# Altium schematic sheet CHIBI SMPS_20181126.SchDoc: Title (part 2 of 2)
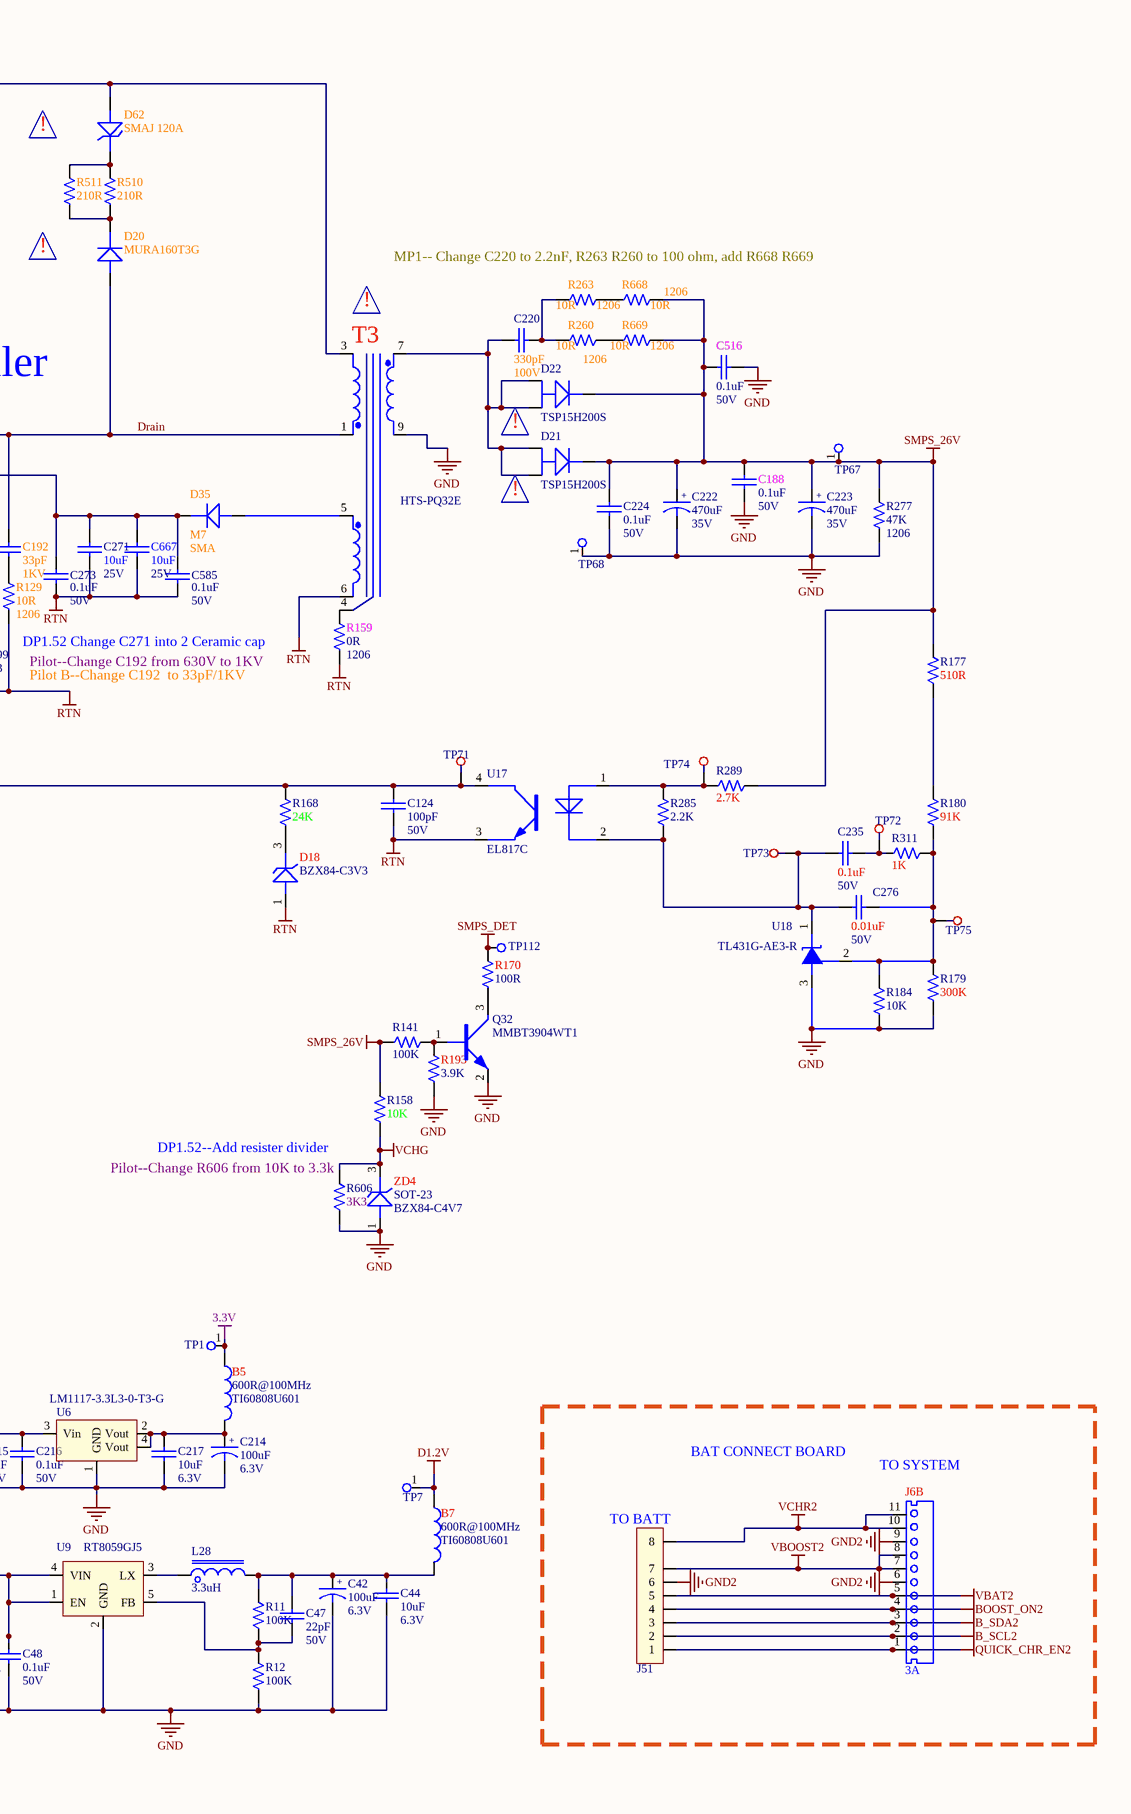
[diagram p2: CHIBI SMPS_20181126.SchDoc, right]

## Library data of the parts
B1-B12 = BEAD 0603 600R@100MHz TI60808U601: CHIP BEAD 600 OHM 25% 100MHZ SMD 0603; SAP: T710500000800; Vendor Code: 10020396; Vendor Name: 深圳市麦新电子有限公司; MFG: 麦新; Impedence: 600R; Current: 1A; Frequency: 100MHZ; Type: INDUCTOR
  B1 B2: MFG Part: TI60808U601
BD1 = GBLA06: DIODE 600V 3A GBLA06 TSC K; MFG: TSC    (台灣半導體); CREAT_NAME: Nathan; SAP: T571002850104; Vendor Code: *; Vendor Name: *; Type: BRIDGE; CREAT_TIME: 17-Jan-2017; MFG Part: GBLA06
C42 C120 C214 = CAP E 100uF 6.3V 20% SMD: CHIP ELECT 100uF 6.3V 20% SMD 5x5.3mm; SAP: T551101414000; Vendor Name: 深圳市春明电子有限公司; Vendor Code: 10020343; MFG: 春明电子; Type: Capacitor; PACKAGE: CASE - C; MFG Part: *; Other: *; Tolerance: 20%
C44 C50 C215 C217 = CAP0603 10uF 6.3V 20%: CHIP CAP 10uF 6.3V 20% 0603 X5R; SAP: T540000002118; Vendor Code: 10010262; Vendor Name: 东莞市晴远电子有限公司; Type: Capacitor; PACKAGE: CAPC0603; MFG: *; MFG Part: *; Other: X5R; Tolerance: 20%
C45 C48 C161 C162 C216 C234 C237 C245 C273 C505 C585 C677 C678 = CAP0402 0.1uF 50V 10%: CAP, CER, 0.1uF, 10%, 50V, X7R, 0402, RoHS; SAP: T542011047508; Type: Capacitor; CREATE_NAME: TOM@Deftronics; PACKAGE: CAPC0402; Vendor Name: *; MFG: *; MFG Part: *; Other: X7R; Tolerance: 10%; CREATE_TIME: 13-May-2014
C46 = CAP0402 0.1uF 50V 10%_X5R_MURATA: CAP X5R .10UF 50V +-10% 0402 MURATA L; Tolerance: 10%; Type: Capacitor; CREATE_NAME: Cherry.Chen; DIP&SMD: SMD; SAP: T545011047505; PACKAGE: CAPC0402; Vendor Name: *; MFG: MURATA; MFG Part: *; Other: X5R; CREATE_TIME: 25-Feb-2016; Customer Specific: N/A
C47 = CAP0402 22pF 50V 5%: CHIP CAP 5% 50V 0402 NPO 22pF; SAP: T541012206508; Type: Capacitor; CREATE_NAME: GordonL@Deftronics; PACKAGE: CAPC0402; Vendor Code: *; Vendor Name: *; MFG: *; MFG Part: *; Other: NPO; Tolerance: 5%; CREATE_TIME: 08-MAR-2013
C51 C52 C58 C60 = CAP0805 10uF 25V 10%: CAP, CER, 10uF, 10%, 25V, X5R, 0805, RoHS; SAP: T545031067408; Type: Capacitor; CREATE_NAME: TOM@Deftronics; PACKAGE: CAP0805; Vendor Code: *; Vendor Name: *; MFG: *; MFG Part: *; Other: X5R; Tolerance: 10%; CREATE_TIME: 13-May-2014
C109 C227 C666 = CAP1210 0.1uF 500V 10%_X7R_KEMET: CAP X7R .10UF 500V +-10% 1210 KEMET L; Tolerance: 10%; Type: Capacitor; CREATE_NAME: Nathan; SAP: T542051047906; PACKAGE: CAP1210; Vendor Code: *; Vendor Name: *; MFG: KEMET; MFG Part: *; Other: X7R; CREATE_TIME: 24-Oct-2016
C111 C275 = CAP E 220uF 35V 20% SMD: CHIP ELECT 20% 35V SMD D8xL10.2mm 220uF; SAP: T551221452010; Type: Capacitor; PACKAGE: CASE - D; Vendor Name: *; Vendor Code: *; MFG: *; MFG Part: *; Other: *; Tolerance: 20%
C121 C222 C223 = CAP E 470uF 35V 20% SMD_VZH471M1V1013-TR0: E 470UF 35V +-20% 10*12. VZH471M1V K; MFG: LELON; Tolerance: 20%; Type: Capacitor; CREAT NAME: Nathan; SAP: T551471455000; PACKAGE: 470uF/35V; Vendor Name: *; Vendor Code: *; MFG Part: VZH471M1V1013-TR0; Other: *; CREAT TIME: 08-July-2016
C124 C232 = CAP0603 100pF 50V 5% - PXL410370-1010: GP CHIP CAP 100pF 50V 5% 0603 TYPE NPO; SAP: T541021016508; Vendor Code: 10010262; Vendor Name: ???????????; Type: Capacitor; PACKAGE: CAPC0603; MFG: *; MFG Part: *; Other: NPO; Tolerance: 5%
C125 = CAP0603 390pF 50V 5%_NPO_WALSIN: CAP NPO 390PF 50V +-5% 0603 WALSIN L; Tolerance: 5%; Type: Capacitor; CREATE_NAME: Nathan; SAP: T541023916508; PACKAGE: CAPC0603; Vendor Name: *; MFG: WALSIN; MFG Part: *; Other: NPO; CREATE_TIME: 13-July-2016
C131 = CAP0805 4.7uF 50V 10%: CHIP CAP 4.7uF 50V 10% 0805 TYPE X7R; SAP: T545034757508; Vendor Code: 10010262; Vendor Name: 东莞市晴远电子有限公司; Type: Capacitor; CREAT NAME: Nathan; PACKAGE: CAPC0805; MFG: *; MFG Part: *; Other: X7R; Tolerance: 10%; CREAT TIME: 16-SEP-2015
C182 = CAP0603 1uF 50V 10%_X7R_WALSIN: CAP X7R 1.0UF 50V +-10% 0603 WALSIN L; Tolerance: 10%; Type: Capacitor; CREATE_NAME: Nathan; SAP: T542021057508; PACKAGE: CAPC0603; Vendor Name: *; MFG: WALSIN; MFG Part: *; Other: X7R; CREATE_TIME: 13-July-2016
C188 C210 C224 C239 C350 C516 C630 C631 = CAP0603 0.1uF 50V 10% - PXL456470-1040: GP CHIP CAP 0.1uF 50V 10% 0603 TYPE X7R; SAP: T542021047508; Vendor Code: 10010262; Vendor Name: ???????????; Type: Capacitor; PACKAGE: CAPC0603; MFG: *; MFG Part: *; Other: X7R; Tolerance: 10%
C192 = CAP1206 33pF 1KV 5%_NPO_WALSIN: CAP NPO 33PF 1KV +-5% 1206 WALSIN L; MFG: WALSIN (華新); Tolerance: 5%; Type: Capacitor; CREATE_NAME: Nathan; SAP: T541043306H08; PACKAGE: CAP1206; Vendor Code: *; Vendor Name: *; MFG Part: *; Other: NPO; CREATE_TIME: 27-Dec-2017
C193 C503 = CAP0402 330pF 50V 5%: CHIP CAP WALSIN 5% 50V 0402 NPO 330pF; SAP: T541013316508; CREATE_NAME: GordonL@Deftronics; Type: Capacitor; PACKAGE: CAPC0402; Vendor Code: *; Vendor Name: *; MFG: Walsin; MFG Part: *; Other: NPO; Tolerance: 5%; CREATE_TIME: 19-OCT-2012
C195 C235 = CAP0603 0.1uF 50V 10% - PXL456470-1040: GP CHIP CAP 0.1uF 50V 10% 0603 TYPE X7R; SAP: T542021047508; Vendor Code: 10010262; Vendor Name: 东莞市晴远电子有限公司; Type: Capacitor; PACKAGE: CAPC0603; MFG: *; MFG Part: *; Other: X7R; Tolerance: 10%
C211 = CAP 0.22uF 275V 10% -T6W18H12 PH15: COND SAFETY 0.22uF 275V 10% X2; MFG Part: MPX224KP2APEL1DH02; SAP: T564224313080; MFG: STRONG(實全); Type: Capacitor; CREATE_NAME: Nathan; PACKAGE: *; Vendor Name: *; Vendor Code: *; Other: X2; Tolerance: 10%; CREATE_TIME: 13-AUG-2015
C212 = CAP SAFETY 0.47uF 275V 10%: COND SAFETY 0.47uF 275V 10% X2; SAP: T564474313090; Vendor Name: 惠州市佳维诚电子有限公司; Vendor Code: 10020154; Type: Capacitor; PACKAGE: 0.47uF/275V; MFG Part: *; Other: X2; Tolerance: 10%
C218 C219 = CAP E Aluminum 82uF 450V 20%: E 82UF 450V +-20% 18X25M KM820M450K250A K; MFG: CAPXON; Tolerance: 20%; Type: Capacitor; CREAT_NAME: Nathan; SAP: T5528204D3010; PACKAGE: 82uF/450V; Vendor Name: *; Vendor Code: *; MFG Part: KM820M450K250A; Other: *; CREAT_TIME: 17-Jan-2017
C220 = CAP0603 330pF 100V 10% - PXL4564A0-3310: CHIP CAP 330pF 100V 10%; SAP: T542023317608; Vendor Code: 10010262; Vendor Name: 东莞市晴远电子有限公司; Type: Capacitor; PACKAGE: CAPC0603; MFG: *; MFG Part: *; Other: *; Tolerance: 10%
C225 = CAP 2200PF Y1 102M40AXC3  Y1 222M40AXC3: 2200PF 400VAC ±20%; MFG: 实全电子; Type: Capacitor; CREATE_NAME: Tom; SAP: T564222414030; PACKAGE: *; Vendor Code: *; Vendor Name: *; MFG Part: *; Other: *; Tolerance: 20%; CREATE_TIME: 20-Aug-2015
C230 = CAP1206 100pF 500V 5%: CHIP CAP 100pF 500V 5% 1206 NPO; MFG Part: 68PF  1KV  1206; Vendor Code: 10010262; Vendor Name: 东莞市晴远电子有限公司; Type: Capacitor; Value: 22PpF; PACKAGE: CAPC1206; MFG: *; Other: NPO; Tolerance: 5%; Voltage: 500V
C238 C253 = CAP0603 0.1uF 50V 10% - PXL456470-1040: GP CHIP CAP 0.1uF 50V 10% 0603 TYPE X7R; SAP: T542021047508; Vendor Code: 10010262; Type: Capacitor; PACKAGE: CAPC0603; MFG: *; MFG Part: *; Other: X7R; Tolerance: 10%
C264 = CAP0603 100pF 50V 5% - PXL410370-1010: GP CHIP CAP 100pF 50V 5% 0603 TYPE NPO; SAP: T541021016508; Vendor Code: 10010262; Vendor Name: 东莞市晴远电子有限公司; Type: Capacitor; PACKAGE: CAPC0603; MFG: *; MFG Part: *; Other: NPO; Tolerance: 5%
C271 C667 = CAP1206 10uF 25V 10%: CHIP CAP 10UF 25V 10% 1206 X5R; SAP: T542041067408; Vendor Code: 10010262; Vendor Name: 东莞市晴远电子有限公司; Type: Capacitor; PACKAGE: CAPC1206; MFG: *; MFG Part: *; Other: X5R; Tolerance: 10%
C276 = CAP0603 0.01uF 50V 5%_X7R_WALSIN: CAP X7R .01UF 50V +-5% 0603 WALSIN L; Tolerance: 5%; Type: Capacitor; CREATE_NAME: Nathan; SAP: T542021036508; PACKAGE: CAPC0603; Vendor Name: *; MFG: WALSIN; MFG Part: *; Other: X7R; CREATE_TIME: 13-July-2016
C298 C304 = CAP0603 10uF 10V 20%_T54000000260E: CAP 10UF 10V +-20% 0603X5R SAMSUNG L; Other: X5R; Tolerance: 20%; Type: Capacitor; CREATE_NAME: Cherry.Chen; SAP: T54000000260E; PACKAGE: CAPC0603; Vendor Code: *; Vendor Name: *; MFG: SAMSUNG; MFG Part: *; CREATE_TIME: 25-Feb-2016
C299 C629 = CAP E  22uF 25V 20%_SMD: CHIP ELECT 20% 25V 5MM; SAP: T551220442020; MFG: CAPXON; Type: Capacitor; CREATE NAME: Tom; Vendor Name: *; Vendor Code: *; MFG Part: *; Other: *; Tolerance: 20%; CREATE TIME: 01-Apr-2015
C501 C502 = CAP0402 0.01uF 50V 10%: CAP, CER, 0.01uF, 10%, 50V, X7R, 0402, RoHS; SAP: T542011037508; Type: Capacitor; CREATE_NAME: Evan@Deftronics; PACKAGE: CAPC0402; Vendor Name: *; MFG: *; MFG Part: *; Other: X7R; Tolerance: 10%; CREATE_TIME: 26-May-2014
C592 C597 = CAP0402 10pF 50V_5%_C0G_SAMSUNG: CAP 10PF 50V +-5% 0402C0G SAMSUNG L; Other: C0G; Tolerance: 5%; Type: Capacitor; CREATE_NAME: Nathan; SAP: DNI; PACKAGE: CAPC0402; Vendor Name: *; MFG: SAMSUNG; MFG Part: *; CREATE_TIME: 17-Aug-2016
C679 = CAP0603 0.022uF 50V 10%: GP CHIP CAP 0.022uF 50V 10%; SAP: T542022237508; Vendor Code: 10010262; Vendor Name: 东莞市晴远电子有限公司; Type: Capacitor; PACKAGE: CAPC0603; MFG: *; MFG Part: *; Other: *; Tolerance: 10%
CY1 CY2 = CAP SAFETY 1nF 400V 10% Y2_PLY1365K0-1040: SAFETY CAP Y2 10% 400V -40'~+100'C 1nF Y5P; MFG: 实全; Create Name: Tom; SAP: DNI; PACKAGE: 1nF\400V; Vendor Name: *; Vendor Code: *; MFG Part: *; Other: Y5P; Tolerance: 10%; Create Time: 27-Apr-2015; Type: Capacitor; Voltage: 400V
D11 D25 D28 = SBR3U40P1-7: DIODE 40V 3A SBR3U40P1-7 DIODE K; MFG: DIODES  (ZETEX); CREATE_NAME: Nathan; SAP: T571002830230; Vendor Name: *; Vendor Code: *; Voltage: 40V; Current: 3A; Type: DIODE; CREATE_TIME: 17-Nov-2016; MFG Part: SBR3U40P1-7
D18 = BZX84-C3V3: CHIP ZENER 3.3V 5% 0.5W SOT-23; MFG: NXP; Power: 500MW; CREATE_NAME: Tom; SAP: T573000910415; Tolerance: 5%; Voltage: 3.3V; Current: *; Vendor Code: *; Vendor Name: *; Type: ZENER; CREATE_TIME: 04-Jan-2016; MFG Part: BZX84-C3V3
D19 = SK34B_TSC: SWITC 28V 3A SK34B TSC K; MFG: TSC    (台灣半導體); Vrrm: 40V; Type: DIODE; Ifsm: 70A; CREAT NAME: Nathan; SAP: T572006222208; Vendor Name: *; Vendor Code: *; If(av): 3A; CREAT TIME: 09-Nov-2017; Vdc: 40V; Vr(rms): 28V
D20 = MURA160T3G: DIODE 600V 1A MURA160T3G ON K; MFG: ON Semiconductor; Current: 1.0A; CREATE_NAME: Nathan; SAP: T571002720225; Vendor Name: *; Vendor Code: *; Voltage: 600V; CREATE_TIME: 31-Oct-2017; Type: DIODE; Package: SMA; MFG Part: MURA160T3G
D21 D22 = TSP15H200S: SWITC 200V 15A TSP15H200S TSC G; MFG: Taiwan Semiconductor; Type: DIODE; CREATE_NAME: Tom; SAP: T572005721008; Vdc: *; Ir: *; Vendor Code: *; Vendor Name: *; CREATE_TIME: 22-Feb-2016; Vf: *; MFG Part: TSP15H200S
D29 D30 D35 = DIO M7: DIODE 1000 1.0A M7 PINGW K; MFG: PINGWEI   (重慶平偉); Voltage: 1000V; Current: 1A; CREAT NAME: Nathan; SAP: T571002880658; Vendor Name: *; Vendor Code: *; Type: DIODE; Package: SMA; CREAT TIME: 11-Sep-2017
D36 = 1N4148WS: DIODE SW 1N4148 VF=0.7V SOD-323; MFG: TW SEMICONDUCTOR; SAP: T572005070208; Voltage: 100V; Current: 150MA; Vendor Name: *; Vendor Code: *; Type: DIODE; Package: SOD-323; MFG Part: 1N4148WS
D55 D56 = DAN217S3-0-T1-G: ITC 100V 215MA DAN217S3-0-T1-G CYSTE K; MFG: CYSTECH; Type: DIODES; Create Name: Nathan; SAP: T572006171251; Vendor Name: *; Vendor Code: *; MFG Part: DAN217S3-0-T1-G; Create Time: 08-Sep-2017
D62 = SMAJ 120A: SWITC 120V 1.0A SMAJ120A TSC K; MFG: Taiwan Semiconductor; Ippm: 1.6A; CREATE_NAME: Nathan; Type: DIODE; SAP: T572006272108; Vendor Name: *; Vendor Code: *; Voltage: 120V; CREATE_TIME: 31-Oct-2017; Package: SMA; MFG Part: SMAJ 120A
F1 = FUSE-TE5-5A250V_L8.5W4H8: FUSE DIP FUSE 250V 5A 8X8.5 39215 K; MFG: Littelfuse; Create Name: Nathan; SAP: T690100003600; Vendor Code: *; Vendor Name: *; Current: 5A; Voltage: 250V; Type: FUSE; Create Time: 11-Sep-2017
J2A = HOUSING  6P 2X3 PH=2.54mm 180  H8.5mm_2.54Y-2X3P-11.5: HOUSING DUAL PIN 2*3PIN 2.54MM DIP 180 K; MFG: JINJIA; Create Name: Nathan; Value: 2.54mm; SAP: T690300110100; MFG Part: 2.54Y-2X3P-11.5; Vendor Name: *; Vendor Code: *; Type: Connector; Current: *; Create Time: 11-Sep-2017
J2B = HEAD 6P 2X3 PH=2.54mm 180 H8.5: CONNECTOR 2X3P 2.54 K; MFG Part: 2.54-2X3A-1; Value: 2.54mm; MFG: 金佳电子; CREAT_NAME: Nathan; SAP: T690300101200; Vendor Name: *; Vendor Code: *; Type: Connector; CREAT_TIME: 16-Jan-2017
J6A J6B = CONN 11P PH=2.5 ST TJC3-11A-CS: CONNECTER 11PIN P=2.54 DIP180° K; Value: 2.5mm; MFG: JINJIA; CREATE_NAME: Nathan; SAP: T690300109800; MFG Part: TJC3-11A-CS; Vendor Name: *; Vendor Code: *; Type: Connector; CREATE_TIME: 11-Sep-2017
J11 = CONN 2P PH=3.96mm RM Mid-PIN_JINJIA_VH-3A2-01: CONNECTOR 2PIN 3.96MM DIP 180 K; CREAT NAME: Nathan; Value: 3.96mm; SAP: T690300109500; MFG: *; MFG Part: *; Vendor Name: *; Vendor Code: *; Type: Connector; CREAT TIME: 12-Sep-2017
J51 = HEAD 8P PH=2.5mm SR ST TSB1-05281-3BT8A: CONNECTOR 2.5MM 8PIN DIP 180 K; MFG: 欣讯科技股份有限公司; CREATE_NAME: Nathan; Current: 3A; Value: 2.5mm; SAP: T690300109900; MFG Part: TSB1-05281-3BT8A; Vendor Name: *; Vendor Code: *; Type: Connector; CREATE_TIME: 12-Sep-2017
L11 L12 L18 = BEAD 1812 120R@100MHz FBMA-11-453215-121A90T: CHIP BEAD 120 OHM 25% 100MHZ 9A 1812 K; MFG: KING CORE; Type: INDUCTOR; Impedance: 120R; SAP: T710500015400; Frequency: 100MHZ; Vendor Code: *; Vendor Name: *; Current: 9A
  L18: MFG Part: FBMA-11-453215-121A90T
L25 L29 = IND 22uH CKST0505-22UH\M: 22UH 2 5A 100K 5.7X CENKER CKST050 K; Type: INDUCTOR; CREATE_NAME: Nathan; Irms: 1.5A; Isat: 2.5A; SAP: T621000054100; MFG: CENKER; Vendor Code: *; Vendor Name: *; Voltage: *; CREATE_TIME: 27-Dec-2017; MFG Part: CKST0505-22UH\M
L27 = IND 10uH CKCS6045-10UH\M: 10UH 4.2A 100K 6.0X CENKER CKCS6045-10UH\M K; Type: INDUCTOR; CREATE_NAME: Nathan; SAP: T621000050100; MFG: CENKER; Vendor Code: *; Vendor Name: *; Voltage: *; CREATE_TIME: 10-May-2017; Current: *
L28 = IND 3.3uH CKCS252012-3.3UH\M-L: 3.3UH 1.35A 1MHZ 2520 MICROG MPIT252 G; MFG: CENKER; Type: INDUCTOR; CREATE_NAME: Nathan; DCR: 174mOHM; Isat: 1.3A; SAP: T621000050300; Vendor Code: *; Vendor Name: *; Voltage: *; CREATE_TIME: 10-May-2017; Irms: 1.35A; MFG Part: CKCS252012-3.3UH\M-L
LED1 = MS-PTB2012CURSGAC_RED/BLUE: SMD LED 2.0x1.25mm  MS-PTB2012CURSBAC   RED/BLUE; MFG Part: MS-PTB2012CURSGAC  RED/BLUE; SAP: T575009310253; MFG: MASON; CREATE_NAME: Evan@Deftronics; Vendor Code: *; Vendor Name: *; Type: LED; CREATE_TIME: 28-Apr-2014
MOV1 = MOV TVR14561RSY: MOV 350VA TVR14561KSY DIP TKS G; SAP: T591000149300; CREATE_NAME: Tom; Vendor Code: *; Vendor Name: *; MFG: TKS; MFG Part: TVR14561RSY; Type: MOV; CREATE_TIME: 27-Apr-2015
Q14 = TSM70N380CP: NMOS 700V TSM70N380CP TO252( TSC G; CREATE_NAME: Tom; MFG: TSC; SAP: T586000010398; Voltage: 700V; Current: *; Power: *; Vendor Code: *; Vendor Name: *; Type: NMOS; CREATE_TIME: 21-Jan-2016; MFG Part: TSM70N380CP
Q18 = 2N7002DW: SMD MOSFET N-CH SOT-363 2N7002DW      Fairchild; SAP: T586002602738; CREATE_NAME: Evan@Deftronics; MFG: Fairchild; Vendor Name: *; Vendor Code: *; Voltage: *; Current: *; Type: MOSFET; CREATE_TIME: 7-May-2014; MFG Part: 2N7002DW
Q30 Q31 = CJQ4407: PMOS 30V CJQ4407 SOP JCET G; Type: PMOSFET; CREATE_NAME: Tom; SAP: T585002521866; MFG: JCET; Vendor Code: *; Vendor Name: *; CREATE_TIME: 18-Apr-2016; Package: SO8; MFG Part: CJQ4407
Q32 = MMBT3904WT1: NPN 40V MMBT3904WT1 SC70 ( ON K; CREATE_NAME: Nathan; SAP: T581003992440; MFG: ON; Vendor Code: *; Vendor Name: *; Voltage: *; Type: NPN; CREATE_TIME: 17-Oct-2017; Current: *; MFG Part: MMBT3904WT1
R11 R12 R141 R143 R163 R174 R176 R208 R209 R679 = RES0402 1/16W 1% 100K OHM-QCF161240-1003: CHIP RES 100K OHM 1/16W 1% 0402; SAP: T502100301399; MFG: WALSIN; Vendor Code: *; Power: *; Vendor Name: *; MFG Part: *; TOL: 1%; Type: Resistor; PACKAGE: 0402
R30 = RES0402 1/16W 5% 0 OHM: CHIP RES 0 OMH 1/16W 5% 0402; SAP: T5020000014A9; MFG: WALSIN; DIP&SMD: SMD; Vendor Code: *; Power: 1/16W; Vendor Name: *; MFG Part: *; TOL: 5%; Type: Resistor; PACKAGE: 0402; Customer Specific: N/A
R66 = RES0603 1/10W 0.1% 100 OHM 50PPM: CHIP 100 OHM 50PPM +-1% 0603 WALS G; Power: 0.1W; CREATE_NAME: Tom; Vendor Code: *; SAP: T502100002399; Vendor Name: *; MFG: *; MFG Part: *; Type: Resistor; CREATE_TIME: 15-Sep-2015; PACKAGE: 0603
R129#1 R251 = RES0603 1/10W 1% 560 OHM: GP CHIP RES. 560 OHM 1/10W 1% 0603; Vendor Code: 10010262; SAP: T502560002399; Vendor Name: 东莞市晴远电子有限公司; Power: *; MFG Part: *; MFG: *; TOL: 1%; Type: Resistor; PACKAGE: 0603
R129#2 R260 R263 R668 R669 = RES1206 1/4W 5% 10 OHM: CHIP 10 OHM 100PPM +-5% 1206 WALS L; Vendor Code: 10010262; SAP: T502010004499; Vendor Name: 东莞市晴远电子有限公司; MFG: WALSIN (華新); TOL: 5%; Power: *; MFG Part: *; Type: Resistor
R130 R157 R170 R173 = RES0402 1/16W 1% 100 OHM: CHIP RES 100 OHM 1/16W 1% 0402; SAP: T502100001399; MFG: WALSIN; Vendor Code: *; Power: *; Vendor Name: *; MFG Part: *; TOL: 1%; Type: Resistor; PACKAGE: 0402
R158 R306 R310 R315 = RES0402 1/16W 1% 10K OHM: CHIP RES 10K OHM 1/16W 1% 0402; SAP: T502100201399; MFG: WALSIN; TOL: 1%; MFG Part: *; Vendor Code: *; Vendor Name: *; Type: Resistor; Power: *
  R158 R310: PACKAGE: 0402
R159 = RES1206 1/4W 5% 0 OHM: GP CHIP RES. 0 OHM 1/4W 5% 1206; Vendor Code: 10010262; SAP: T502000004499; Vendor Name: 东莞市晴远电子有限公司; Power: *; MFG Part: *; MFG: *; TOL: 5%; Type: Resistor
R160 = RES0603 1/10W 1% 100 OHM: CHIP 100 OHM 100PPM +-1% 0603 WALS L; Vendor Code: 10010262; SAP: T502100002399; Vendor Name: 东莞市晴远电子有限公司; MFG: WALSIN (華新); TOL: 1%; Power: *; MFG Part: *; Type: Resistor; PACKAGE: 0603
R161 = RES0805 1/8W 1% 47 OHM: GP CHIP RES. 47 OHM 1/8W 1% 0805; Vendor Code: 10010262; SAP: T502470A03399; Vendor Name: 东莞市晴远电子有限公司; Power: *; MFG Part: *; MFG: *; TOL: 1%; Type: Resistor; PACKAGE: 0805
R167 = RES0805 1/8W 1% 10K OHM: GP CHIP RES. 10K OHM 1/8W 1% 0805; Vendor Code: 10010262; SAP: T502100203399; Vendor Name: 东莞市晴远电子有限公司; Power: *; MFG Part: *; MFG: *; TOL: 1%; Type: Resistor; PACKAGE: 0805
R168 = RES0603 1/10W 1% 24K OHM: GP CHIP RES 24K OHM 1/10W 1% 0603; Vendor Code: 10010262; SAP: T502240202399; Vendor Name: 东莞市晴远电子有限公司; Power: *; MFG Part: *; MFG: *; TOL: 1%; Type: Resistor; PACKAGE: 0603
R177 = RES0603 1/10W 1% 510 OHM: GP CHIP RES. 510 OHM 1/10W 1% 0603; Vendor Code: 10010262; SAP: T502510002399; Vendor Name: 东莞市晴远电子有限公司; Power: *; MFG Part: *; MFG: *; TOL: 1%; Type: Resistor; PACKAGE: 0603
R179 = RES0603 1/10W 1% 300K OHM: CHIP RES. 300K OHM 1/10W 1% 0603; Vendor Code: 10010262; SAP: T502300302399; Vendor Name: 东莞市晴远电子有限公司; Power: *; MFG Part: *; MFG: *; TOL: 1%; Type: Resistor; PACKAGE: 0603
R180 = RES0603 1/10W 1% 82K OHM: GP CHIP RES. 91K OHM 1/10W 1% 0603; Vendor Code: 10010262; SAP: T502910202399; Vendor Name: 东莞市晴远电子有限公司; Power: *; MFG Part: *; MFG: *; TOL: 1%; Type: Resistor; PACKAGE: 0603
R184 = RES0603 1/10W 1% 10K OHM: GP CHIP RES. 10K OHM 1/10W 1% 0603; Vendor Code: 10010262; SAP: T502100202399; Vendor Name: 东莞市晴远电子有限公司; Power: *; MFG Part: *; MFG: *; TOL: 1%; Type: Resistor; PACKAGE: 0603
R193 = RES0402 1/16W 1% 3.9K OHM: CHIP RES 3.9K OHM 1/16W 1% 0402; SAP: T502390101399; MFG: WALSIN; Vendor Code: *; Power: *; Vendor Name: *; MFG Part: *; TOL: 1%; Type: Resistor; PACKAGE: 0402
R196 = RES0402 1/16W 1% 680K OHM: CHIP RES 680K OHM 1% 1/16W 0402; SAP: T502680301399; CREATE_NAME: TOM@Deftronics; Package: 0402; TOL: 1%; MFG Part: *; MFG: *; Vendor Code: *; Vendor Name: *; Type: Resistor; Power: 1/16W; CREATE_TIME: 09-Jul-2014
R210 = RES0603 1/10W 1% 220 OHM: GP CHIP RES. 220 OHM 1/10W 1% 0603; Vendor Code: 10010262; SAP: T502220002399; Vendor Name: 东莞市晴远电子有限公司; Power: *; MFG Part: *; MFG: *; TOL: 1%; Type: Resistor; PACKAGE: 0603
R214 = RES0402 1/16W 5.6K: CHIP RES 5.6K OHM 1/16W; CREATE_NAME: Tom; Vendor Code: *; SAP: T502560101399; Power: *; Vendor Name: *; MFG Part: *; MFG: *; TOL: *; Type: Resistor; CREATE_TIME: 09-Sep-2015; PACKAGE: 0402
R254-R257 = RES1206 1/4W 1% 820K OHM: CHIP RES 820K OHM 1/4W 1% 1206; Vendor Code: 10010262; SAP: T502820304399; Vendor Name: 东莞市晴远电子有限公司; Power: *; MFG Part: *; MFG: *; TOL: 1%; Type: Resistor
R268 = RES1206 1/4W 1% 4.7 OHM: CHIP RES 4.7 OHM 1/4 W 1% 1206; Vendor Code: 10010262; Vendor Name: 东莞市晴远电子有限公司; MFG: 4.7R  1206; Value: 4.7R; Power: *; MFG Part: *; TOL: 1%; Type: Resistor; PACKAGE: 1206
R277 = RES1206 1/4W 1% 47K OHM: CHIP RES. 47K OHM 1206 1%; Vendor Code: 10010262; SAP: T502470204399; Power: 1/4W; Vendor Name: 东莞市晴远电子有限公司; MFG Part: *; MFG: *; TOL: 1%; Type: Resistor
R283 = RES0603 1/10W 1% 470 OHM: CHIP RES. 470 OHM 1/10W 1% 0603; Vendor Code: 10010262; SAP: T502470002399; Vendor Name: 东莞市晴远电子有限公司; Power: *; MFG Part: *; MFG: *; TOL: 1%; Type: Resistor; PACKAGE: 0603
R285 = RES0603 1/10W 1% 2.2K OHM: GP CHIP RES. 2.2K OHM 1/10W 1% 0603; Vendor Code: 10010262; SAP: T502220102399; Vendor Name: 东莞市晴远电子有限公司; Power: *; MFG Part: *; MFG: *; TOL: 1%; Type: Resistor; PACKAGE: 0603
R287 R295 R297 R299 R502 = RES1206 1/4W 1% 1.3 OHM_KOA: CHIP 1.3 OHM 100PPM +-1% 1206 KOA K; MFG Part: SR732BTTD1R30F; TOL: 1%; CREAT_NAME: Nathan; Vendor Code: *; SAP: T710600016700; Power: *; Vendor Name: *; MFG: KOA; Type: Resistor; PACKAGE: 1206; CREAT_TIME: 12-Sep-2017
R289 = RES0603 1/10W 1% 2.7K OHM: CHIP RES 2.7K OHM 1/10W 1% 0603; Vendor Code: 10010262; SAP: T502270102399; Vendor Name: 东莞市晴远电子有限公司; Power: *; MFG Part: *; MFG: *; TOL: 1%; Type: Resistor; PACKAGE: 0603
R302 R303 = RES0402 1/16W 1% 27K OHM: CHIP RES 27K OHM 1/16W 1% 0402; SAP: T502270201399; CREATE_NAME: GordonL@Deftronics; Vendor Code: *; Power: *; Vendor Name: *; MFG Part: *; MFG: *; TOL: 1%; Type: Resistor; CREATE_TIME: 11-Mar-2014; PACKAGE: 0402
R304 R305 = RES0402 1/16W 1% 47K OHM: CHIP RES 47K 1/16W 1% 0402; SAP: T502470201399; MFG: WALSIN; Vendor Code: *; Power: *; Vendor Name: *; MFG Part: *; TOL: 1%; Type: Resistor
R307 R328 R352 = RES0402 1/16W 1% 56K OHM: CHIP RES 56K OHM 1% 1/16W 0402; SAP: T502560201399; CREATE_NAME: GordonL@Deftronics; Vendor Code: *; Power: *; Vendor Name: *; MFG Part: *; MFG: *; TOL: 1%; Type: Resistor; CREATE_TIME: 18-Feb-2014; PACKAGE: 0402
R311 = RES0603 1/10W 1% 1K OHM: GP CHIP RES. 1K OHM 1/10W 1% 0603; Vendor Code: 10010262; SAP: T502100102399; Vendor Name: 东莞市晴远电子有限公司; Power: *; MFG: *; MFG Part: *; TOL: 1%; Type: Resistor; PACKAGE: 0603
R321 = RES0603 1/10W 1% 1.37K OHM_WALSIN: CHIP 1.37K OHM 100PPM +-1% 0603 WALS L; MFG: WALSIN (華新); TOL: 1%; CREAT_NAME: Nathan; Vendor Code: *; SAP: T502137102399; Power: *; Vendor Name: *; MFG Part: *; Type: Resistor; PACKAGE: 0603; CREAT_TIME: 03-July-2016
R351 = RES0603 1/10W 1% 51K OHM: CHIP RES 51K OHM 1/10W 1% 0603; Vendor Code: 10010262; SAP: T502510202399; Vendor Name: 东莞市晴远电子有限公司; Power: *; MFG Part: *; MFG: *; TOL: 1%; Type: Resistor; PACKAGE: 0603
R356 = RES0603 1/10W 1% 3K OHM: CHIP RES 3K OHM 1/10W 1% 0603; Vendor Code: 10010262; SAP: T502300102399; Vendor Name: 东莞市晴远电子有限公司; Power: *; MFG Part: *; MFG: *; TOL: 1%; Type: Resistor; PACKAGE: 0603
R499 R500 = RES1206 1/4W 1% 2.2K OHM: CHIP RES. 2.2K OHM 1/4W 1% 1206; Vendor Code: 10010262; SAP: T502220104399; Vendor Name: 东莞市晴远电子有限公司; MFG Part: *; MFG: *; TOL: 1%; Type: Resistor; Power: 1/4W
R501 = RES1206 1/4W 1% 1 OHM_KOA: CHIP 1 OHM 100PPM +-1% 1206 KOA K; MFG Part: SR732BTTD1R00F; TOL: 1%; CREAT NAME: Nathan; Vendor Code: *; SAP: T710600016600; Power: *; Vendor Name: *; MFG: KOA; Type: Resistor; CREAT TIME: 12-Sep-2017
R510 R511 = RES1206 1/4W 1% 210 OHM_WALSIN: CHIP 210 OHM 100PPM +-1% 1206 WALS L; MFG: WALSIN (華新); TOL: 1%; CREAT_NAME: Nathan; Vendor Code: *; SAP: T502210004399; Power: *; Vendor Name: *; MFG Part: *; Type: Resistor; CREAT_TIME: 03-Dec-2017
R601 = RES0603 1/10W 1% 10K OHM: GP CHIP RES. 10K OHM 1/10W 1% 0603; Vendor Code: 10010262; Vendor Name: 东莞市晴远电子有限公司; SAP: DNI; Power: *; MFG Part: *; MFG: *; TOL: 1%; Type: Resistor; PACKAGE: 0603
R606 = RES0402 1/16W 1% 3.3K OHM: CHIP RES 3.3K OHM 1/16W 1% 0402; SAP: T502330101399; MFG: WALSIN; Vendor Code: *; Power: *; Vendor Name: *; MFG Part: *; TOL: 1%; Type: Resistor; PACKAGE: 0402
R610 R611 = RES0805 1/8W 1% 1M OHM: GP CHIP RES. 1M OHM 1/8W 1% 0805; Vendor Code: 10010262; SAP: T502100403399; Vendor Name: 东莞市晴远电子有限公司; Power: *; MFG Part: *; MFG: *; TOL: 1%; Type: Resistor; PACKAGE: 0805
RT1 = NTC MF72-8D13: NTC THERMISTOR RES 17*7.5mm MF72-8D13弯; SAP: T710600007800; MFG: APR; CREATE_NAME: Tom@Deftronics; Vendor Code: *; Vendor Name: *; Type: NTC; CREATE_TIME: 22-Sep-2013; MFG Part: MF72-8D13
RT2 = NTC NCP15WF104F03RC: 100K 0402 NTC K; MFG: MURATA; CREAT_NAME: Nathan; SAP: T710600016200; Vendor Code: *; Vendor Name: *; Type: NTC; Value: 100K; CREAT_TIME: 17-Jan-2017
SW55 = ROCKER SW RS601K-103: SEESAW SWITCH RS601K-1030002BB K; MFG: 创恩; CREATE_NAME: Tom; SAP: T670000000300; Vendor Name: *; Vendor Code: *; Type: Swith; CREATE_TIME: 11-Nov-2016; MFG Part: RS601K-1030002BB
T1 T2 = COMMON IND HLE-FT19A: 12MH 6A 1KHZ DIP GLORIA HLE-FT1 K; MFG: GLORIA TECHNOLOGY  LLC; CREATE_NAME: Nathan; Type: INDUCTOR; SAP: T621000052200; Vendor Code: *; Vendor Name: *; CREATE_TIME: 12-Sep-2017
T3 = X-FMR HTS-PQ32E: TRANSF 26V 85-2 10 GLORIA HTS-PQ32E K; CREATE_NAME: Nathan; Type: TRANSFORMER; CREATE_TIME: 19-Jan-2017; MFG: GLORIA; SAP: T622000009700; Value: *; Vendor Code: *; Vendor Name: *; MFG Part: HTS-PQ32E
TP1 TP7 = TP
TP71-TP75 = TP_1.0mm: 1mm diameter test point. NOT IN BOM - Fabricated on PCB
U6 = LM1117-3.3L3-0-T3-G: REG LM1117-3.3L3-0-T3 SOT223 CYSTECH K; MFG: CYSTECH (全宇昕科技); CREAT NAME: Nathan; SAP: T610600101194; Vendor Code: *; Vendor Name: *; Type: IC; MFG Part: LM1117-3.3L3-0-T3-G; Package: SOT-223; CREAT TIME: 12-Sep-2017
U9 = RT8059: DC DC CVT RT8059GJ5 TSOT23-5 RICHTEK H; SAP: T611700035815; CREATE_NAME: Evan@Deftronics; Optional: USD (和611700018915交易帋艅e不一樣)帋帋I嶪S嶪S嶪S嶪S嶪S嶪S嶪S嶪S嶪S嶪S嶪S嶪S; MFG: RICHTEK; Vendor Code: *; Vendor Name: *; Type: IC; CREATE_TIME: 25-Jun-2014
U15 = LV2843: REG LV2843 TSOT23-6 TI G; SAP: T610600090405; CREATE_NAME: Nathan; MFG: TI; Vendor Code: *; Vendor Name: *; Package: TSOT-6L; CREATE_TIME: 03-Feb-2015
U16 = RT7781G: SP RT7781GGS SOP-7 RICHTEK K; CREAT_NAME: Nathan; SAP: T610000055710; MFG: RICHTEK; Vendor Code: *; Vendor Name: *; Type: IC; CREAT_TIME: 04-NOV-2016
U17 = EL817C-S1: IC 4PIN SMT EL817C  Ever Light; SAP: T58A000491533; Vendor Code: 10020351; Vendor Name: 深圳市貛亿光电有限公司; MFG: Everlight; Type: IC
U18 = TL431G-AE3-R_UTC_T610600100708: REG TL431G-AE3-R SOT-23 UTC K; CREAT_NAME: Nathan; SAP: T610600100708; MFG: UTC; Vendor Code: *; Vendor Name: *; Type: IC; CREAT_TIME: 10-Aug-2017
U19 = TPS54335: IC TPS54335  SO POWERPAD TI; SAP: T611700035922; CREATE_NAME: Nathan; MFG: TI; Vendor Code: *; Vendor Name: *; Type: IC; CREATE_TIME: 19-Sep-2014
U22 = TPS562200: IC 6P SOT-23  2A 4.5-17V Buck Converter; CREATE_NAME: Evan@Deftronics; MFG: TI; SAP: T610600089505; CREATE_TIME: 10-Jul-2014; TYPE: IC; Value: 2A; Vender Code: *; Vender Name: *; MFG Part: TPS562200
ZD4 = BZX84-C4V7: ZD 4.7V 250MW + -5% SOT-23 NXP G; CREATE_NAME: Tom; SAP: T573004040415; Vendor Code: *; Vendor Name: *; MFG: NXP; Voltage: 4.7V; Current: *; Power: *; Type: DIODE; CREATE_TIME: 04-Mar-2016; MFG Part: BZX84-C4V7